# Altium schematic sheet CSP_circuit - potentiometers.SchDoc
size A4
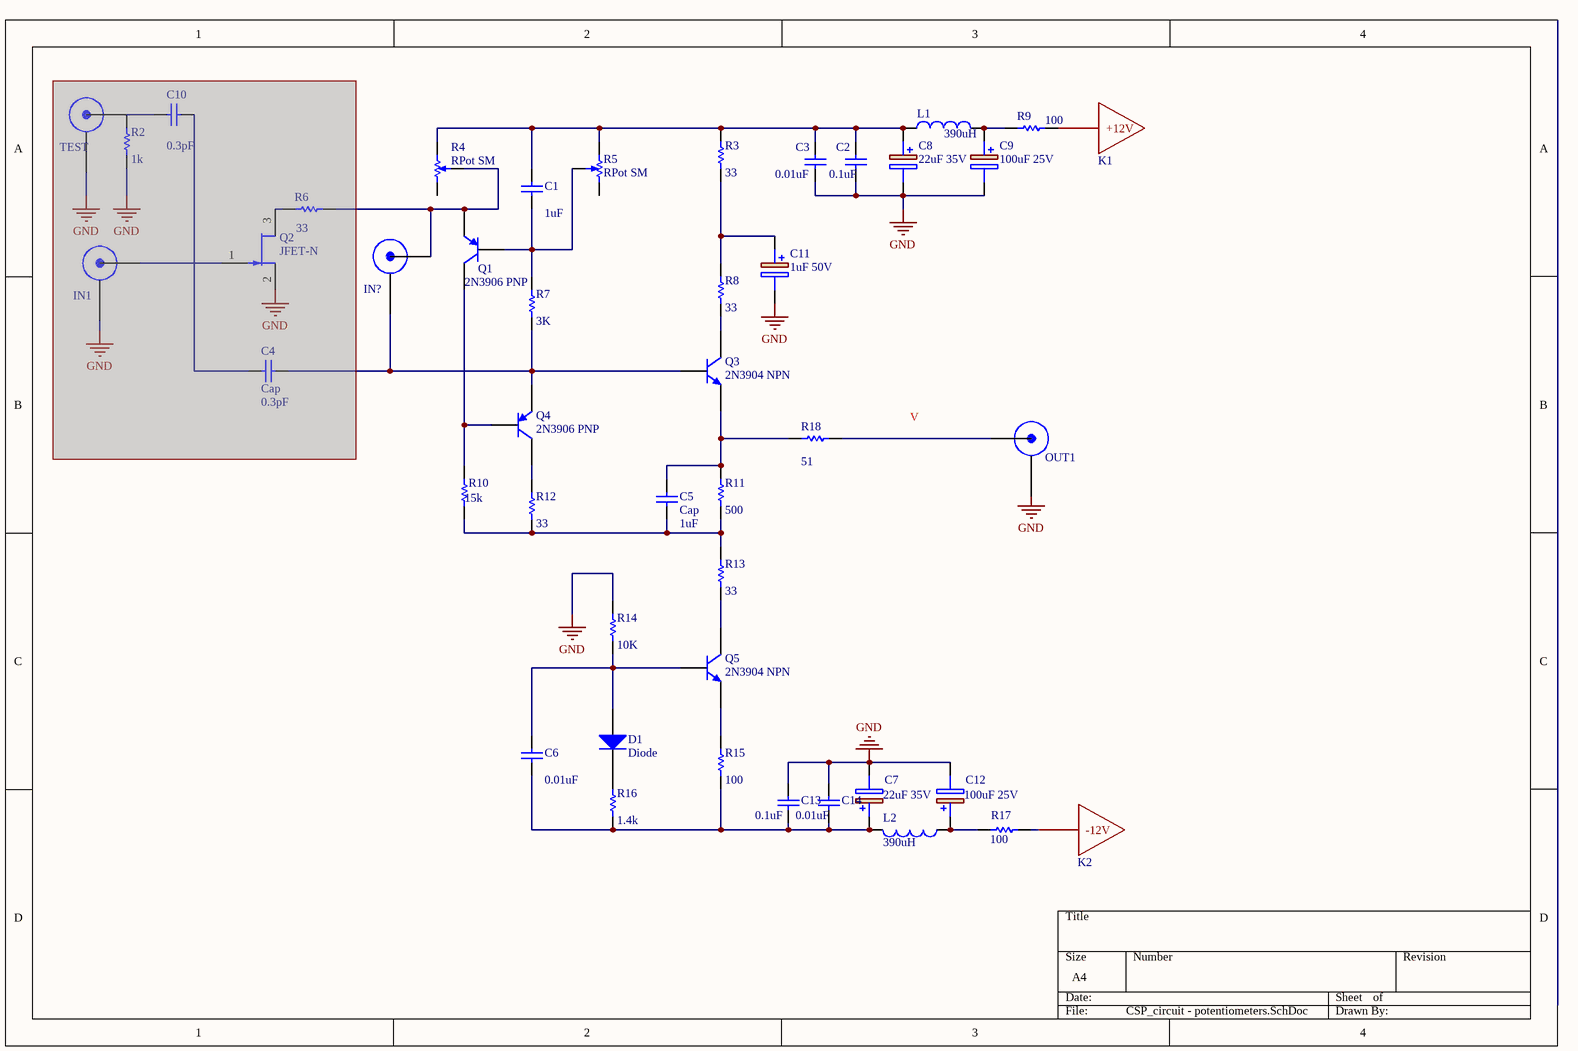
[diagram p0: CSP_circuit - potentiometers.SchDoc]

## Parts
C1  value 1uF  [*CAPC2012X94N]  (hidden comment: Cap)
C2  value 0.1uF  [SMD-0805C]  (hidden comment: Cap)
C3  value 0.01uF  [SMD-0805C]  (hidden comment: Cap)
C4  Cap  value 0.3pF  [0603]  (masked out: inside a compile mask, not in the netlist)
C5  Cap  value 1uF  [*CAPC2012X94N]
C6  value 0.01uF  [*CAPC2012X94N]  (hidden comment: Cap)
C7  22uF 35V  [CAPAE660X550N]
C8  22uF 35V  [CAPAE660X550N]
C9  100uF 25V  [CAPAE660X800N]
C10  value 0.3pF  [0603]  (hidden comment: Cap)  (masked out: inside a compile mask, not in the netlist)
C11  1uF 50V  [CAPAE430X550N]
C12  100uF 25V  [CAPAE660X800N]
C13  value 0.1uF  [SMD-0805C]  (hidden comment: Cap)
C14  value 0.01uF  [SMD-0805C]  (hidden comment: Cap)
D1  Diode  [SODFL350X110-2N]
IN1  INPUT  [IN/OUT]  (value not drawn)  (masked out: inside a compile mask, not in the netlist)
IN?  INPUT  [IN/OUT]  (value not drawn)
K1  +12V  [PAD]  (value not drawn)
K2  -12V  [PAD]  (value not drawn)
L1  390uH  [INDC3225X270N]
L2  390uH  [INDC3225X270N]
OUT1  OUTPUT  [IN/OUT]  (value not drawn)
Q1  2N3906 PNP  [SOT-23B_N]
Q2  JFET-N  [SOT23_M]  (masked out: inside a compile mask, not in the netlist)
Q3  2N3904 NPN  [SOT23_M]
Q4  2N3906 PNP  [SOT-23B_N]
Q5  2N3904 NPN  [SOT23_M]
R2  value 1k  [SMD-0805-RES]  (hidden comment: Res1)  (masked out: inside a compile mask, not in the netlist)
R3  value 33  [SMD-0805-RES]  (hidden comment: Res1)
R4  RPot SM  [POT4MM-2]
R5  RPot SM  [POT4MM-2]
R6  value 33  [SMD-0805-RES]  (masked out: inside a compile mask, not in the netlist)
R7  value 3K  [SMD-0805-RES]  (hidden comment: Res1)
R8  value 33  [SMD-0805-RES]  (hidden comment: Res1)
R9  value 100  [SMD-0805-RES]  (hidden comment: Res1)
R10  value 15k  [SMD-0805-RES]  (hidden comment: Res1)
R11  value 500  [SMD-0805-RES]  (hidden comment: Res1)
R12  value 33  [SMD-0805-RES]  (hidden comment: Res1)
R13  value 33  [SMD-0805-RES]  (hidden comment: Res1)
R14  value 10K  [SMD-0805-RES]  (hidden comment: Res1)
R15  value 100  [SMD-0805-RES]  (hidden comment: Res1)
R16  value 1.4k  [SMD-0805-RES]  (hidden comment: Res1)
R17  100  [SMD-0805-RES]
R18  value 51  [SMD-0805-RES]  (hidden comment: Res1)
TEST  INPUT  [IN/OUT]  (value not drawn)  (masked out: inside a compile mask, not in the netlist)

## Nets
GND: C2.1 C3.1 C7.2(-) C8.2(-) C9.2(-) C11.2(-) C12.2(-) C13.1 C14.1 R14.2
NetC1_1: C1.1 Q1.1(B) R5.W R7.2
NetC1_2: C1.2 C2.2 C3.2 C8.1(+) L1.1 R3.2 R4.CW(+) R5.CCW(-)
NetC5_1: C5.1 R10.1 R11.1 R12.1 R13.2
NetC5_2: C5.2 Q3.2(E) R11.2 R18.2
NetC6_1: C6.1 C7.1(+) C13.2 C14.2 L2.2 R15.1 R16.1
NetC6_2: C6.2 D1.A Q5.3(B) R14.1
NetC9_1: C9.1(+) L1.2 R9.2
NetC11_1: C11.1(+) R3.1 R8.2
NetC12_1: C12.1(+) L2.1 R17.2
NetD1_C: D1.C R16.2
NetIN?_1: IN?.1(IN) Q1.2(E) R4.W
NetIN?_2: IN?.2(GND) Q3.3(B) Q4.2(E) R7.1
NetK1_1: K1.1(+12V) R9.1
NetK2_1: K2.1(-12V) R17.1
NetOUT1_1: OUT1.1(IN) R18.1
NetQ1_3: Q1.3(C) Q4.1(B) R10.2
NetQ3_1: Q3.1(C) R8.1
NetQ4_3: Q4.3(C) R12.2
NetQ5_1: Q5.1(C) R13.1
NetQ5_2: Q5.2(E) R15.2

Not connected (* = marked no-connect by the designer): OUT1 2(GND); R4 CCW(-); R5 CW(+)

## Notes on the sheet
- Labels drawn without touching a wire or pin: GND

## Library data of the parts
C1-C6 C10 C13 C14 = Cap: Capacitor; Published: 8-Jun-2000; LatestRevisionDate: 17-Jul-2002; LatestRevisionNote: Re-released for DXP Platform.; PackageReference: RAD-0.3; Publisher: Altium Limited; PackageDescription: Radial Cap, Thru-Hole; 2 Leads; 0.3 in Pin Spacing
C7 C8 = TYEH1V226F55MTR: 22uF 35V, Capacitor Polarised; Part number: TYEH1V226F55MTR; Value: 22uF; Dimension: 6.3x5.3mm; Voltage: 35V
C9 C12 = EEEFK1E101P: 100uF 25V, cap polarised; Part number: EEEFK1E101P; Dimensions: 8x6.2mm; Voltage: 25V; Value: 100uF
C11 = UWT1H010MCL1GB: 1uF 50V, Capacitor Polarised; Manufacturer_Name: Nichicon; Part number: UWT1H010MCL1GB; Dimensions: 4x5.4mm; Value: 1uF; Voltage: 50V
L1 L2 = NLV10JT391: 390uH, Inductor; Resistance: 36; Value: 390uH; Package: 1210
Q1 Q4 = PNP: PNP Bipolar Transistor; Published: 8-Jun-2000; LatestRevisionDate: 29-May-2009; LatestRevisionNote: IPC-7351 Footprint Added.; PackageVersion: Aug-1999; PackageReference: SOT-23B; Publisher: Altium Limited; PackageDescription: 3-Pin SOT-23 Package 0.95 mm Pitch, 2.4 mm Lead Span
Q2 = JFET-N: N-Channel JFET; Published: 8-Jun-2000; LatestRevisionDate: 17-Jul-2002; LatestRevisionNote: Re-released for DXP Platform.; PackageReference: TO-254-AA; Publisher: Altium Limited; Code_JEDEC: TO-254-AA
Q3 Q5 = NPN: NPN Bipolar Transistor; Published: 8-Jun-2000; LatestRevisionDate: 17-Jul-2002; LatestRevisionNote: Re-released for DXP Platform.; PackageReference: TO-226-AA; Publisher: Altium Limited; PackageDescription: TO, Flat Index; 3 In-Line, Axial Leads; Body Dia. 4.8mm; Leads 0.55 x 0.51 mm (max); Code_JEDEC: TO-226-AA
R2 R3 R6-R18 = Res1: Resistor; Published: 8-Jun-2000; LatestRevisionDate: 17-Jul-2002; LatestRevisionNote: Re-released for DXP Platform.; PackageReference: AXIAL-0.3; Publisher: Altium Limited; PackageDescription: Axial Device, Thru-Hole; 2 Leads; 0.3 in Pin Spacing
  R17: Value: 100
R4 R5 = RPot SM: Square Trimming Potentiometer; Published: 17-Dec-2003; DatasheetVersion: Oct-2003; PackageReference: POT4MM-2; Publisher: Altium Limited; PackageDescription: Square Trimming Potentiometer; ComponentLink1Description: Manufacturer Link; ComponentLink1URL: http://bourns.com/2/search.html